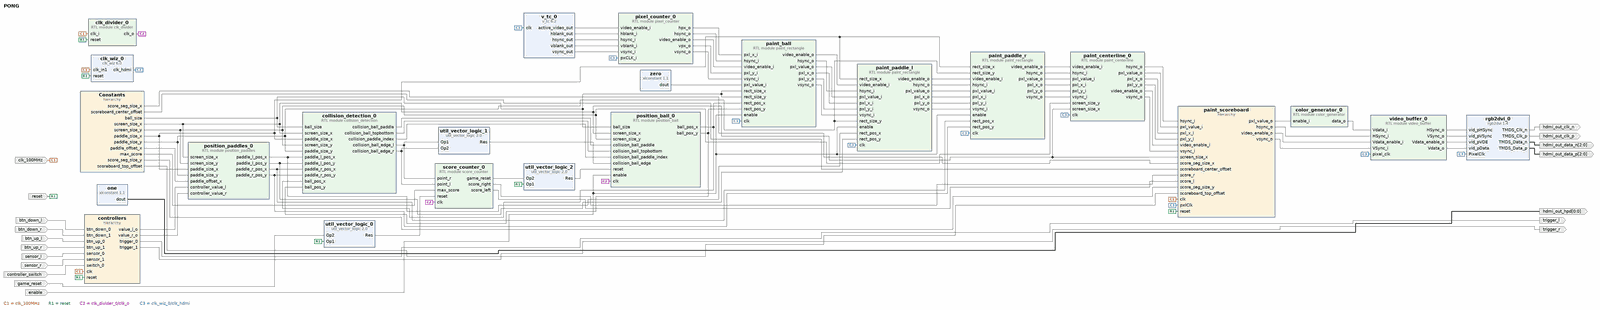
[diagram p0: block diagram of the top level, whole]
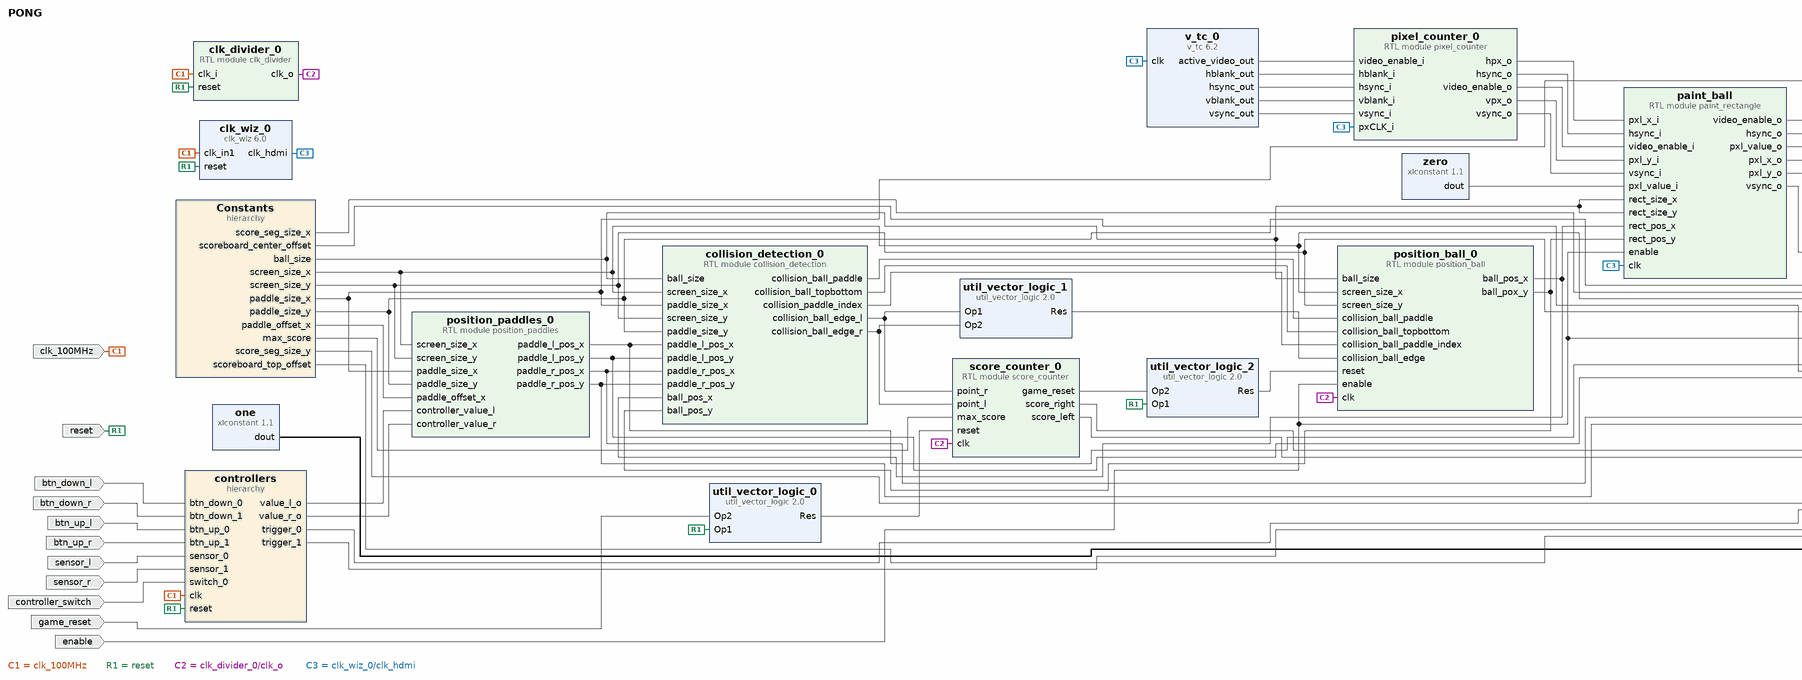
[diagram p1: block diagram of the top level, left part]
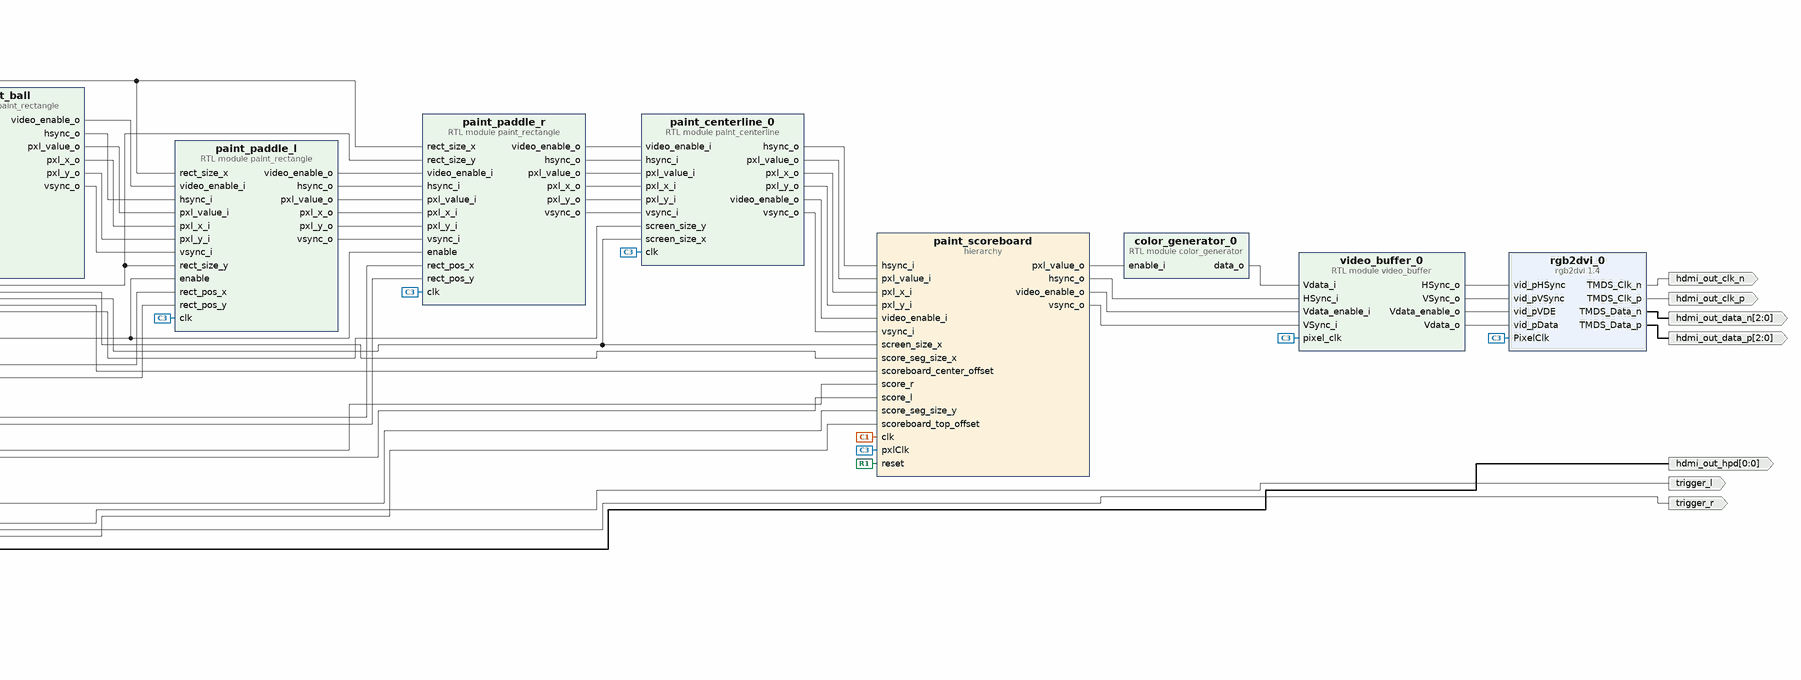
[diagram p2: block diagram of the top level, right part]
# Vivado block design PONG, xc7a35tcpg236-1, Vivado 2023.1
create_bd_design PONG

create_bd_port -dir O trigger_l
create_bd_port -dir O trigger_r
create_bd_port -dir I sensor_l
create_bd_port -dir I sensor_r
create_bd_port -dir I -type rst reset
set_property -dict {CONFIG.POLARITY ACTIVE_HIGH} [get_bd_ports reset]
create_bd_port -dir I controller_switch
create_bd_port -dir I btn_up_l
create_bd_port -dir I btn_down_l
create_bd_port -dir I btn_up_r
create_bd_port -dir I btn_down_r
create_bd_port -dir I enable
create_bd_port -dir O -from 0 -to 0 hdmi_out_hpd
create_bd_port -dir O -type clk hdmi_out_clk_p
create_bd_port -dir O -type clk hdmi_out_clk_n
create_bd_port -dir O -from 2 -to 0 hdmi_out_data_p
create_bd_port -dir O -from 2 -to 0 hdmi_out_data_n
create_bd_port -dir I -type clk clk_100MHz
set_property -dict {CONFIG.FREQ_HZ 100000000} [get_bd_ports clk_100MHz]
create_bd_port -dir I game_reset

create_bd_cell -type hier Constants
create_bd_cell -type hier controllers
create_bd_cell -type hier paint_scoreboard
create_bd_cell -type module -reference clk_divider clk_divider_0
set_property -dict {CONFIG.division 100000} [get_bd_cells clk_divider_0]
create_bd_cell -type module -reference collision_detection collision_detection_0
create_bd_cell -type module -reference paint_rectangle paint_ball
create_bd_cell -type module -reference paint_centerline paint_centerline_0
create_bd_cell -type module -reference paint_rectangle paint_paddle_l
create_bd_cell -type module -reference paint_rectangle paint_paddle_r
create_bd_cell -type module -reference position_ball position_ball_0
create_bd_cell -type module -reference position_paddles position_paddles_0
create_bd_cell -type module -reference score_counter score_counter_0
create_bd_cell -type ip -vlnv xilinx.com:ip:clk_wiz:6.0 clk_wiz_0
set_property -dict [list \
  CONFIG.CLKOUT1_JITTER 217.614 \
  CONFIG.CLKOUT1_PHASE_ERROR 245.344 \
  CONFIG.CLKOUT1_REQUESTED_OUT_FREQ 148.5 \
  CONFIG.CLK_OUT1_PORT clk_hdmi \
  CONFIG.MMCM_CLKFBOUT_MULT_F 37.125 \
  CONFIG.MMCM_CLKOUT0_DIVIDE_F 6.250 \
  CONFIG.MMCM_DIVCLK_DIVIDE 4 \
  CONFIG.PRIM_IN_FREQ 100.000 \
  CONFIG.USE_LOCKED false \
] [get_bd_cells clk_wiz_0]
create_bd_cell -type ip -vlnv xilinx.com:ip:xlconstant:1.1 one
create_bd_cell -type ip -vlnv digilentinc.com:ip:rgb2dvi:1.4 rgb2dvi_0
create_bd_cell -type ip -vlnv xilinx.com:ip:util_vector_logic:2.0 util_vector_logic_1
set_property -dict {CONFIG.C_OPERATION or CONFIG.C_SIZE 1} [get_bd_cells util_vector_logic_1]
create_bd_cell -type ip -vlnv xilinx.com:ip:util_vector_logic:2.0 util_vector_logic_2
set_property -dict {CONFIG.C_OPERATION or CONFIG.C_SIZE 1} [get_bd_cells util_vector_logic_2]
create_bd_cell -type ip -vlnv xilinx.com:ip:v_tc:6.2 v_tc_0
set_property -dict {CONFIG.HAS_AXI4_LITE false CONFIG.VIDEO_MODE 1080p CONFIG.enable_detection false} [get_bd_cells v_tc_0]
create_bd_cell -type ip -vlnv xilinx.com:ip:xlconstant:1.1 zero
set_property -dict {CONFIG.CONST_VAL 0} [get_bd_cells zero]
create_bd_cell -type module -reference color_generator color_generator_0
create_bd_cell -type module -reference pixel_counter pixel_counter_0
create_bd_cell -type module -reference video_buffer video_buffer_0
create_bd_cell -type ip -vlnv xilinx.com:ip:util_vector_logic:2.0 util_vector_logic_0
set_property -dict {CONFIG.C_OPERATION or CONFIG.C_SIZE 1} [get_bd_cells util_vector_logic_0]

# ---- hierarchy /Constants ----
current_bd_instance /Constants
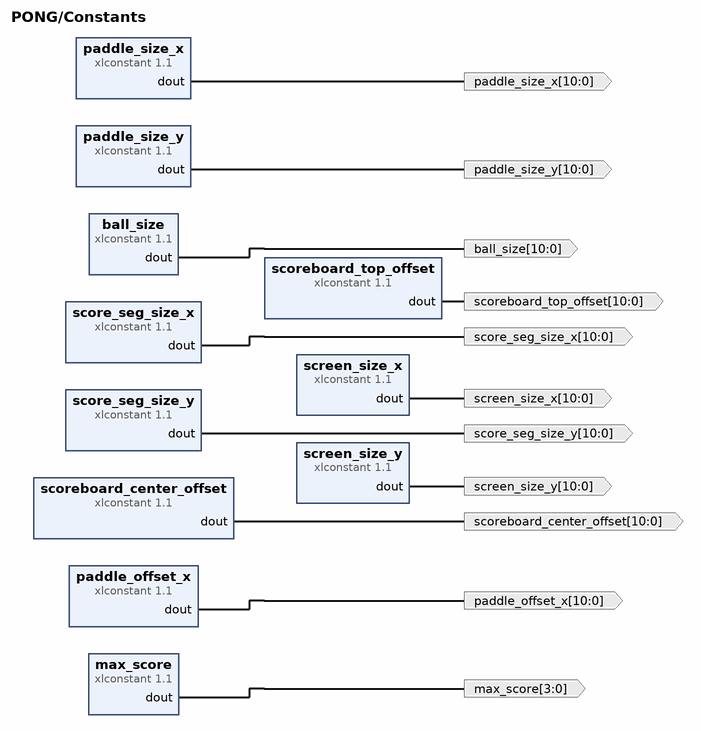
[diagram p3: block diagram inside /Constants]
create_bd_pin -dir O -from 10 -to 0 screen_size_x
create_bd_pin -dir O -from 10 -to 0 screen_size_y
create_bd_pin -dir O -from 10 -to 0 paddle_size_x
create_bd_pin -dir O -from 10 -to 0 paddle_size_y
create_bd_pin -dir O -from 10 -to 0 ball_size
create_bd_pin -dir O -from 10 -to 0 paddle_offset_x
create_bd_pin -dir O -from 3 -to 0 max_score
create_bd_pin -dir O -from 10 -to 0 score_seg_size_x
create_bd_pin -dir O -from 10 -to 0 score_seg_size_y
create_bd_pin -dir O -from 10 -to 0 scoreboard_center_offset
create_bd_pin -dir O -from 10 -to 0 scoreboard_top_offset

create_bd_cell -type ip -vlnv xilinx.com:ip:xlconstant:1.1 ball_size
set_property -dict {CONFIG.CONST_VAL 30 CONFIG.CONST_WIDTH 11} [get_bd_cells ball_size]
create_bd_cell -type ip -vlnv xilinx.com:ip:xlconstant:1.1 max_score
set_property -dict {CONFIG.CONST_VAL 9 CONFIG.CONST_WIDTH 4} [get_bd_cells max_score]
create_bd_cell -type ip -vlnv xilinx.com:ip:xlconstant:1.1 paddle_offset_x
set_property -dict {CONFIG.CONST_VAL 0 CONFIG.CONST_WIDTH 11} [get_bd_cells paddle_offset_x]
create_bd_cell -type ip -vlnv xilinx.com:ip:xlconstant:1.1 paddle_size_x
set_property -dict {CONFIG.CONST_VAL 40 CONFIG.CONST_WIDTH 11} [get_bd_cells paddle_size_x]
create_bd_cell -type ip -vlnv xilinx.com:ip:xlconstant:1.1 paddle_size_y
set_property -dict {CONFIG.CONST_VAL 300 CONFIG.CONST_WIDTH 11} [get_bd_cells paddle_size_y]
create_bd_cell -type ip -vlnv xilinx.com:ip:xlconstant:1.1 score_seg_size_x
set_property -dict {CONFIG.CONST_VAL 50 CONFIG.CONST_WIDTH 11} [get_bd_cells score_seg_size_x]
create_bd_cell -type ip -vlnv xilinx.com:ip:xlconstant:1.1 score_seg_size_y
set_property -dict {CONFIG.CONST_VAL 100 CONFIG.CONST_WIDTH 11} [get_bd_cells score_seg_size_y]
create_bd_cell -type ip -vlnv xilinx.com:ip:xlconstant:1.1 scoreboard_center_offset
set_property -dict {CONFIG.CONST_VAL 100 CONFIG.CONST_WIDTH 11} [get_bd_cells scoreboard_center_offset]
create_bd_cell -type ip -vlnv xilinx.com:ip:xlconstant:1.1 scoreboard_top_offset
set_property -dict {CONFIG.CONST_VAL 20 CONFIG.CONST_WIDTH 11} [get_bd_cells scoreboard_top_offset]
create_bd_cell -type ip -vlnv xilinx.com:ip:xlconstant:1.1 screen_size_x
set_property -dict {CONFIG.CONST_VAL 1920 CONFIG.CONST_WIDTH 11} [get_bd_cells screen_size_x]
create_bd_cell -type ip -vlnv xilinx.com:ip:xlconstant:1.1 screen_size_y
set_property -dict {CONFIG.CONST_VAL 1080 CONFIG.CONST_WIDTH 11} [get_bd_cells screen_size_y]

# ---- hierarchy /controllers ----
current_bd_instance /controllers
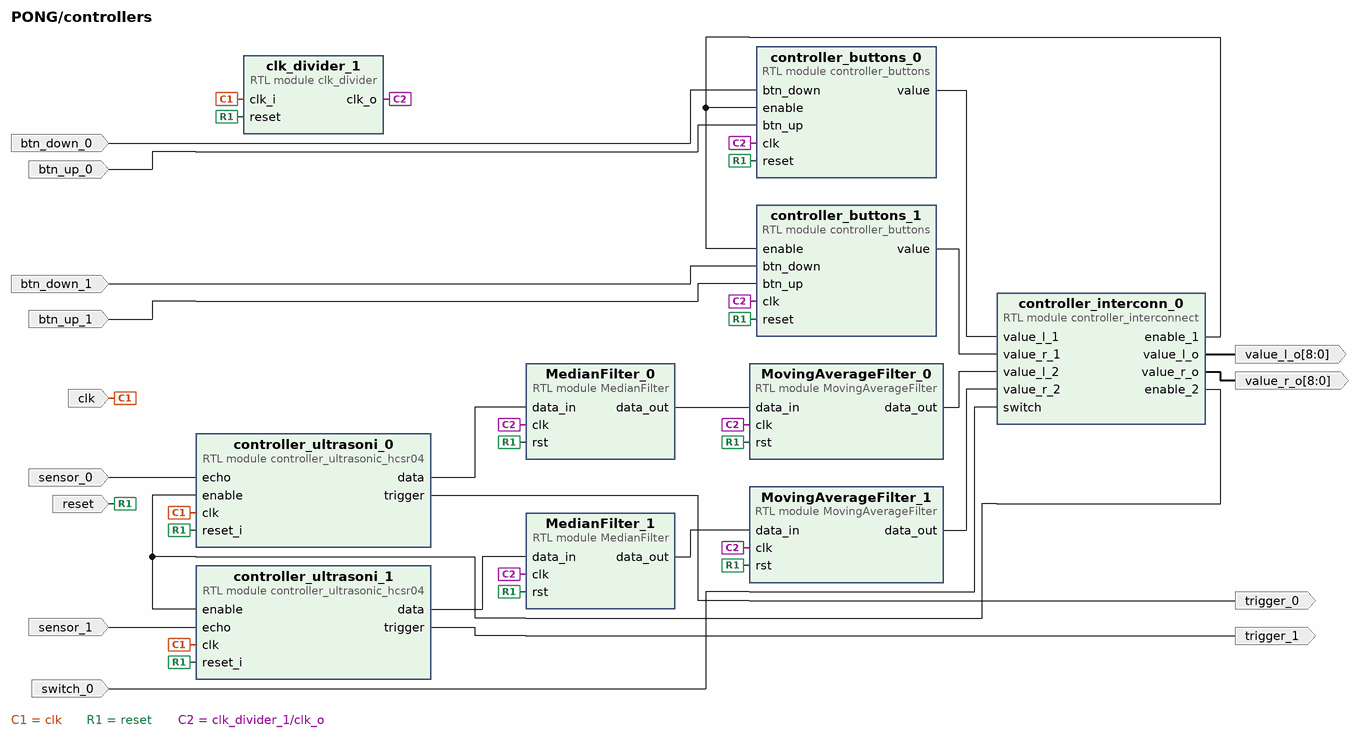
[diagram p4: block diagram inside /controllers]
create_bd_pin -dir I -type clk clk
create_bd_pin -dir I -type rst reset
create_bd_pin -dir I switch_0
create_bd_pin -dir O -from 8 -to 0 value_l_o
create_bd_pin -dir O -from 8 -to 0 value_r_o
create_bd_pin -dir I sensor_0
create_bd_pin -dir O trigger_0
create_bd_pin -dir I sensor_1
create_bd_pin -dir O trigger_1
create_bd_pin -dir I btn_up_1
create_bd_pin -dir I btn_down_1
create_bd_pin -dir I btn_up_0
create_bd_pin -dir I btn_down_0

create_bd_cell -type module -reference clk_divider clk_divider_1
set_property -dict {CONFIG.division 150000} [get_bd_cells clk_divider_1]
create_bd_cell -type module -reference controller_interconnect controller_interconn_0
create_bd_cell -type module -reference controller_buttons controller_buttons_0
create_bd_cell -type module -reference controller_buttons controller_buttons_1
create_bd_cell -type module -reference controller_ultrasonic_hcsr04 controller_ultrasoni_0
set_property -dict {CONFIG.MaxDistance_mm 300 CONFIG.MinDistance_mm 50} [get_bd_cells controller_ultrasoni_0]
create_bd_cell -type module -reference controller_ultrasonic_hcsr04 controller_ultrasoni_1
set_property -dict {CONFIG.MaxDistance_mm 300 CONFIG.MinDistance_mm 50} [get_bd_cells controller_ultrasoni_1]
create_bd_cell -type module -reference MedianFilter MedianFilter_0
create_bd_cell -type module -reference MedianFilter MedianFilter_1
create_bd_cell -type module -reference MovingAverageFilter MovingAverageFilter_0
create_bd_cell -type module -reference MovingAverageFilter MovingAverageFilter_1

# ---- hierarchy /paint_scoreboard ----
current_bd_instance /paint_scoreboard
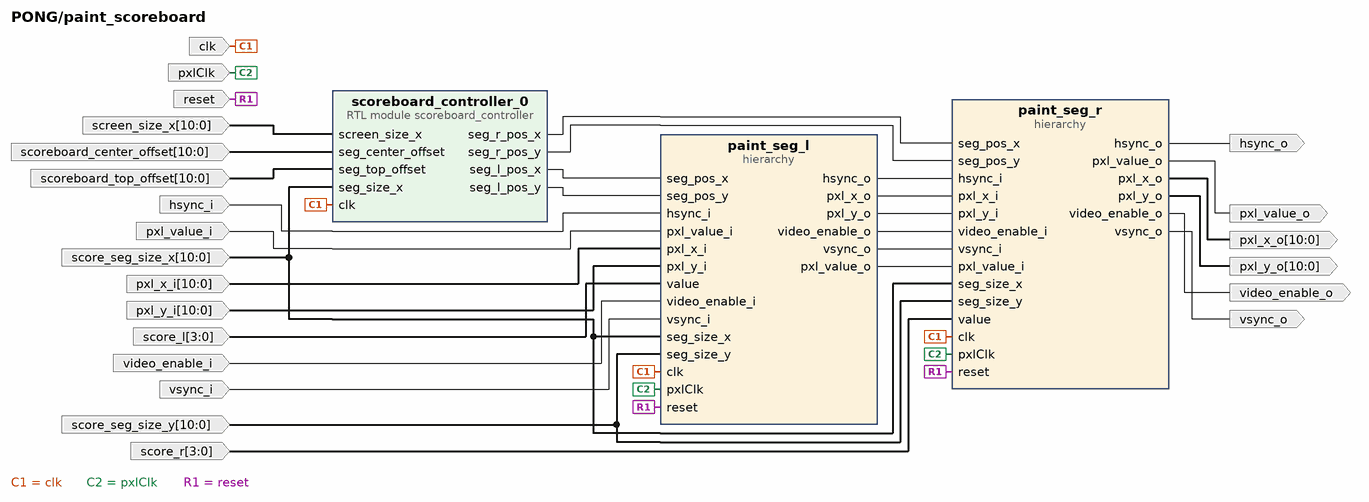
[diagram p5: block diagram inside /paint_scoreboard]
create_bd_pin -dir I video_enable_i
create_bd_pin -dir I hsync_i
create_bd_pin -dir I vsync_i
create_bd_pin -dir I -from 10 -to 0 pxl_x_i
create_bd_pin -dir I -from 10 -to 0 pxl_y_i
create_bd_pin -dir I pxl_value_i
create_bd_pin -dir O video_enable_o
create_bd_pin -dir O hsync_o
create_bd_pin -dir O vsync_o
create_bd_pin -dir O -from 10 -to 0 pxl_x_o
create_bd_pin -dir O -from 10 -to 0 pxl_y_o
create_bd_pin -dir O pxl_value_o
create_bd_pin -dir I pxlClk
create_bd_pin -dir I clk
create_bd_pin -dir I reset
create_bd_pin -dir I -from 3 -to 0 score_l
create_bd_pin -dir I -from 3 -to 0 score_r
create_bd_pin -dir I -from 10 -to 0 score_seg_size_x
create_bd_pin -dir I -from 10 -to 0 score_seg_size_y
create_bd_pin -dir I -from 10 -to 0 screen_size_x
create_bd_pin -dir I -from 10 -to 0 scoreboard_center_offset
create_bd_pin -dir I -from 10 -to 0 scoreboard_top_offset

create_bd_cell -type hier paint_seg_l
create_bd_cell -type hier paint_seg_r
create_bd_cell -type module -reference scoreboard_controller scoreboard_controller_0

# ---- hierarchy /paint_scoreboard/paint_seg_l ----
current_bd_instance /paint_scoreboard/paint_seg_l
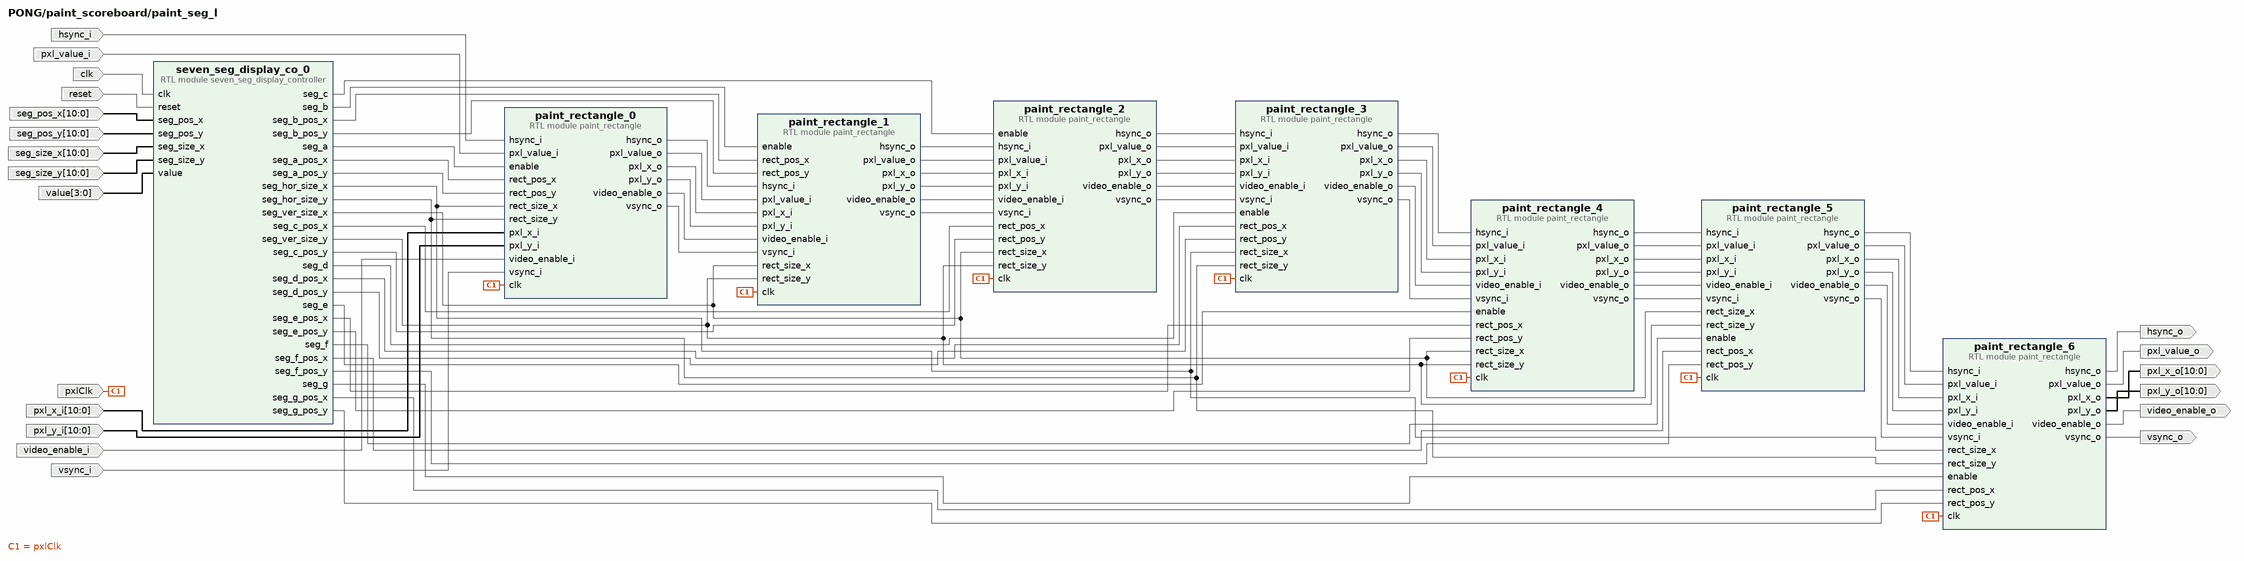
[diagram p6: block diagram inside /paint_scoreboard/paint_seg_l]
create_bd_pin -dir I pxlClk
create_bd_pin -dir I -type clk clk
create_bd_pin -dir I -type rst reset
create_bd_pin -dir I -from 3 -to 0 value
create_bd_pin -dir I -from 10 -to 0 seg_pos_x
create_bd_pin -dir I -from 10 -to 0 seg_pos_y
create_bd_pin -dir I -from 10 -to 0 seg_size_x
create_bd_pin -dir I -from 10 -to 0 seg_size_y
create_bd_pin -dir I video_enable_i
create_bd_pin -dir I hsync_i
create_bd_pin -dir I vsync_i
create_bd_pin -dir I -from 10 -to 0 pxl_x_i
create_bd_pin -dir I -from 10 -to 0 pxl_y_i
create_bd_pin -dir I pxl_value_i
create_bd_pin -dir O video_enable_o
create_bd_pin -dir O hsync_o
create_bd_pin -dir O vsync_o
create_bd_pin -dir O -from 10 -to 0 pxl_x_o
create_bd_pin -dir O -from 10 -to 0 pxl_y_o
create_bd_pin -dir O pxl_value_o

create_bd_cell -type module -reference paint_rectangle paint_rectangle_0
create_bd_cell -type module -reference paint_rectangle paint_rectangle_1
create_bd_cell -type module -reference paint_rectangle paint_rectangle_2
create_bd_cell -type module -reference paint_rectangle paint_rectangle_3
create_bd_cell -type module -reference paint_rectangle paint_rectangle_4
create_bd_cell -type module -reference paint_rectangle paint_rectangle_5
create_bd_cell -type module -reference paint_rectangle paint_rectangle_6
create_bd_cell -type module -reference seven_seg_display_controller seven_seg_display_co_0

# ---- hierarchy /paint_scoreboard/paint_seg_r ----
current_bd_instance /paint_scoreboard/paint_seg_r
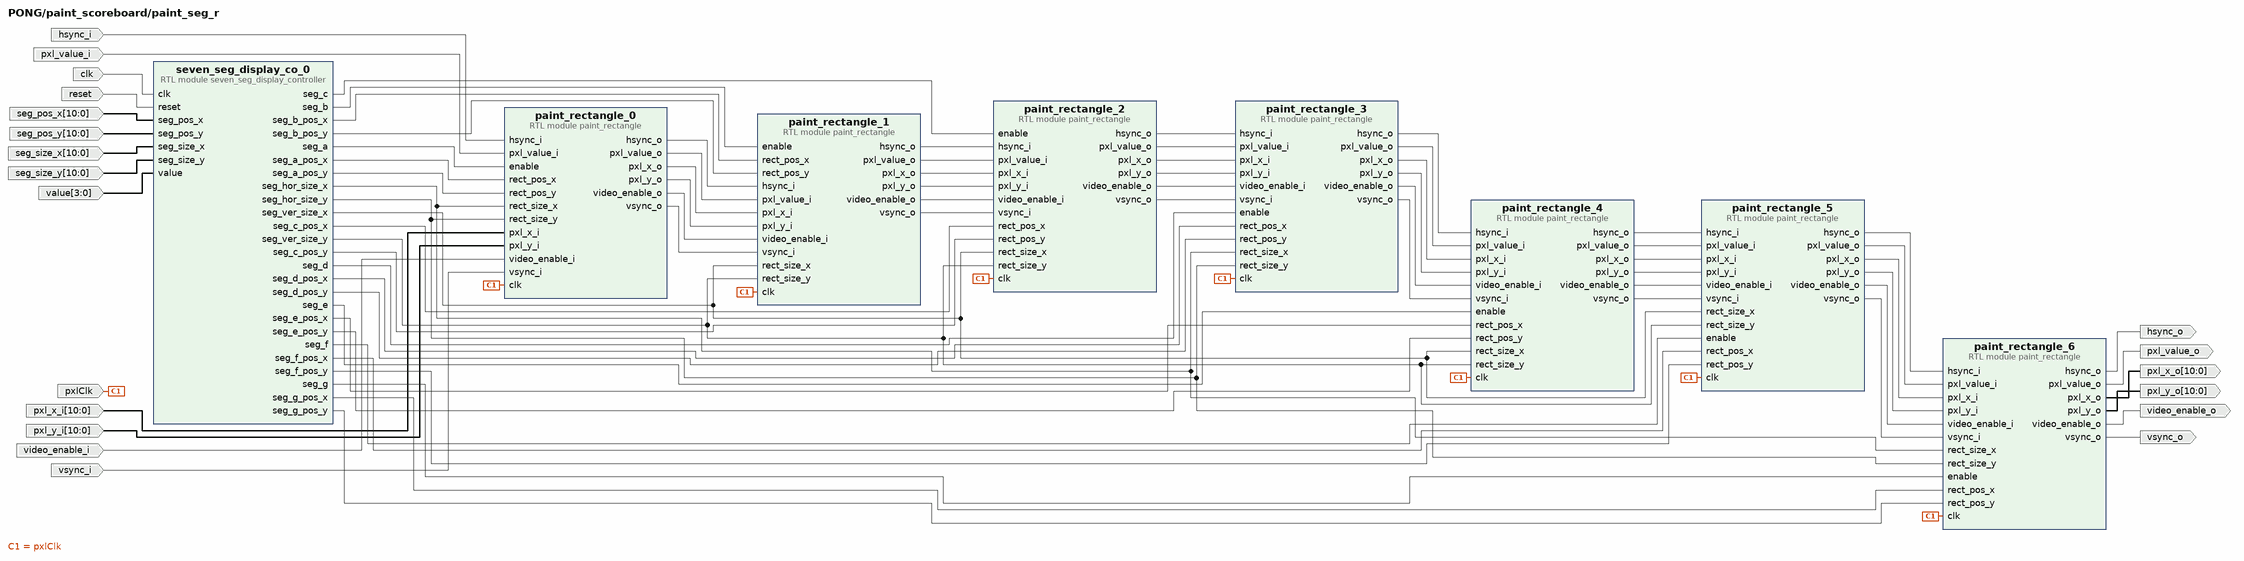
[diagram p7: block diagram inside /paint_scoreboard/paint_seg_r]
create_bd_pin -dir I pxlClk
create_bd_pin -dir I -type clk clk
create_bd_pin -dir I -type rst reset
create_bd_pin -dir I -from 3 -to 0 value
create_bd_pin -dir I -from 10 -to 0 seg_pos_x
create_bd_pin -dir I -from 10 -to 0 seg_pos_y
create_bd_pin -dir I -from 10 -to 0 seg_size_x
create_bd_pin -dir I -from 10 -to 0 seg_size_y
create_bd_pin -dir I video_enable_i
create_bd_pin -dir I hsync_i
create_bd_pin -dir I vsync_i
create_bd_pin -dir I -from 10 -to 0 pxl_x_i
create_bd_pin -dir I -from 10 -to 0 pxl_y_i
create_bd_pin -dir I pxl_value_i
create_bd_pin -dir O video_enable_o
create_bd_pin -dir O hsync_o
create_bd_pin -dir O vsync_o
create_bd_pin -dir O -from 10 -to 0 pxl_x_o
create_bd_pin -dir O -from 10 -to 0 pxl_y_o
create_bd_pin -dir O pxl_value_o

create_bd_cell -type module -reference paint_rectangle paint_rectangle_0
create_bd_cell -type module -reference paint_rectangle paint_rectangle_1
create_bd_cell -type module -reference paint_rectangle paint_rectangle_2
create_bd_cell -type module -reference paint_rectangle paint_rectangle_3
create_bd_cell -type module -reference paint_rectangle paint_rectangle_4
create_bd_cell -type module -reference paint_rectangle paint_rectangle_5
create_bd_cell -type module -reference paint_rectangle paint_rectangle_6
create_bd_cell -type module -reference seven_seg_display_controller seven_seg_display_co_0

# ---- connections ----

current_bd_instance /Constants
connect_bd_net [get_bd_pins screen_size_x/dout] [get_bd_pins screen_size_x]
connect_bd_net [get_bd_pins screen_size_y/dout] [get_bd_pins screen_size_y]
connect_bd_net [get_bd_pins paddle_size_x/dout] [get_bd_pins paddle_size_x]
connect_bd_net [get_bd_pins paddle_size_y/dout] [get_bd_pins paddle_size_y]
connect_bd_net [get_bd_pins ball_size/dout] [get_bd_pins ball_size]
connect_bd_net [get_bd_pins score_seg_size_x/dout] [get_bd_pins score_seg_size_x]
connect_bd_net [get_bd_pins score_seg_size_y/dout] [get_bd_pins score_seg_size_y]
connect_bd_net [get_bd_pins scoreboard_center_offset/dout] [get_bd_pins scoreboard_center_offset]
connect_bd_net [get_bd_pins scoreboard_top_offset/dout] [get_bd_pins scoreboard_top_offset]
connect_bd_net -net xlconstant_5_dout [get_bd_pins paddle_offset_x/dout] [get_bd_pins paddle_offset_x]
connect_bd_net -net xlconstant_6_dout [get_bd_pins max_score/dout] [get_bd_pins max_score]

current_bd_instance /controllers
connect_bd_net [get_bd_pins MedianFilter_0/data_out] [get_bd_pins MovingAverageFilter_0/data_in]
connect_bd_net [get_bd_pins MedianFilter_1/data_out] [get_bd_pins MovingAverageFilter_1/data_in]
connect_bd_net [get_bd_pins MovingAverageFilter_0/data_out] [get_bd_pins controller_interconn_0/value_l_2]
connect_bd_net [get_bd_pins MovingAverageFilter_1/data_out] [get_bd_pins controller_interconn_0/value_r_2]
connect_bd_net [get_bd_pins clk] [get_bd_pins clk_divider_1/clk_i] [get_bd_pins controller_ultrasoni_0/clk] [get_bd_pins controller_ultrasoni_1/clk]
connect_bd_net [get_bd_pins controller_interconn_0/enable_2] [get_bd_pins controller_ultrasoni_0/enable] [get_bd_pins controller_ultrasoni_1/enable]
connect_bd_net [get_bd_pins reset] \
  [get_bd_pins clk_divider_1/reset] [get_bd_pins controller_buttons_0/reset] [get_bd_pins controller_buttons_1/reset] \
  [get_bd_pins controller_ultrasoni_0/reset_i] [get_bd_pins controller_ultrasoni_1/reset_i] [get_bd_pins MedianFilter_0/rst] \
  [get_bd_pins MedianFilter_1/rst] [get_bd_pins MovingAverageFilter_0/rst] [get_bd_pins MovingAverageFilter_1/rst]
connect_bd_net -net btn_down_0_1 [get_bd_pins btn_down_0] [get_bd_pins controller_buttons_0/btn_down]
connect_bd_net -net btn_down_1_1 [get_bd_pins btn_down_1] [get_bd_pins controller_buttons_1/btn_down]
connect_bd_net -net btn_up_0_1 [get_bd_pins btn_up_0] [get_bd_pins controller_buttons_0/btn_up]
connect_bd_net -net btn_up_1_1 [get_bd_pins btn_up_1] [get_bd_pins controller_buttons_1/btn_up]
connect_bd_net [get_bd_pins clk_divider_1/clk_o] \
  [get_bd_pins controller_buttons_0/clk] [get_bd_pins controller_buttons_1/clk] [get_bd_pins MedianFilter_0/clk] \
  [get_bd_pins MedianFilter_1/clk] [get_bd_pins MovingAverageFilter_0/clk] [get_bd_pins MovingAverageFilter_1/clk]
connect_bd_net [get_bd_pins controller_buttons_0/value] [get_bd_pins controller_interconn_0/value_l_1]
connect_bd_net [get_bd_pins controller_buttons_1/value] [get_bd_pins controller_interconn_0/value_r_1]
connect_bd_net [get_bd_pins controller_interconn_0/enable_1] [get_bd_pins controller_buttons_0/enable] [get_bd_pins controller_buttons_1/enable]
connect_bd_net [get_bd_pins controller_interconn_0/value_l_o] [get_bd_pins value_l_o]
connect_bd_net [get_bd_pins controller_interconn_0/value_r_o] [get_bd_pins value_r_o]
connect_bd_net [get_bd_pins controller_ultrasoni_0/data] [get_bd_pins MedianFilter_0/data_in]
connect_bd_net [get_bd_pins controller_ultrasoni_0/trigger] [get_bd_pins trigger_0]
connect_bd_net [get_bd_pins controller_ultrasoni_1/data] [get_bd_pins MedianFilter_1/data_in]
connect_bd_net [get_bd_pins controller_ultrasoni_1/trigger] [get_bd_pins trigger_1]
connect_bd_net -net sensor_0_1 [get_bd_pins sensor_0] [get_bd_pins controller_ultrasoni_0/echo]
connect_bd_net -net sensor_1_1 [get_bd_pins sensor_1] [get_bd_pins controller_ultrasoni_1/echo]
connect_bd_net -net switch_0_1 [get_bd_pins switch_0] [get_bd_pins controller_interconn_0/switch]

current_bd_instance /paint_scoreboard
connect_bd_net [get_bd_pins clk] [get_bd_pins paint_seg_r/clk] [get_bd_pins paint_seg_l/clk] [get_bd_pins scoreboard_controller_0/clk]
connect_bd_net [get_bd_pins hsync_i] [get_bd_pins paint_seg_l/hsync_i]
connect_bd_net [get_bd_pins paint_seg_l/hsync_o] [get_bd_pins paint_seg_r/hsync_i]
connect_bd_net [get_bd_pins paint_seg_l/pxl_x_o] [get_bd_pins paint_seg_r/pxl_x_i]
connect_bd_net [get_bd_pins paint_seg_l/pxl_y_o] [get_bd_pins paint_seg_r/pxl_y_i]
connect_bd_net [get_bd_pins paint_seg_l/video_enable_o] [get_bd_pins paint_seg_r/video_enable_i]
connect_bd_net [get_bd_pins paint_seg_l/vsync_o] [get_bd_pins paint_seg_r/vsync_i]
connect_bd_net [get_bd_pins paint_seg_r/hsync_o] [get_bd_pins hsync_o]
connect_bd_net [get_bd_pins paint_seg_r/pxl_value_o] [get_bd_pins pxl_value_o]
connect_bd_net [get_bd_pins paint_seg_r/pxl_x_o] [get_bd_pins pxl_x_o]
connect_bd_net [get_bd_pins paint_seg_r/pxl_y_o] [get_bd_pins pxl_y_o]
connect_bd_net [get_bd_pins paint_seg_r/video_enable_o] [get_bd_pins video_enable_o]
connect_bd_net [get_bd_pins paint_seg_r/vsync_o] [get_bd_pins vsync_o]
connect_bd_net [get_bd_pins pxlClk] [get_bd_pins paint_seg_l/pxlClk] [get_bd_pins paint_seg_r/pxlClk]
connect_bd_net -net pxl_value_i_1 [get_bd_pins paint_seg_l/pxl_value_o] [get_bd_pins paint_seg_r/pxl_value_i]
connect_bd_net [get_bd_pins pxl_value_i] [get_bd_pins paint_seg_l/pxl_value_i]
connect_bd_net [get_bd_pins pxl_x_i] [get_bd_pins paint_seg_l/pxl_x_i]
connect_bd_net [get_bd_pins pxl_y_i] [get_bd_pins paint_seg_l/pxl_y_i]
connect_bd_net [get_bd_pins reset] [get_bd_pins paint_seg_l/reset] [get_bd_pins paint_seg_r/reset]
connect_bd_net [get_bd_pins scoreboard_controller_0/seg_l_pos_x] [get_bd_pins paint_seg_l/seg_pos_x]
connect_bd_net [get_bd_pins scoreboard_controller_0/seg_l_pos_y] [get_bd_pins paint_seg_l/seg_pos_y]
connect_bd_net [get_bd_pins scoreboard_controller_0/seg_r_pos_x] [get_bd_pins paint_seg_r/seg_pos_x]
connect_bd_net [get_bd_pins scoreboard_controller_0/seg_r_pos_y] [get_bd_pins paint_seg_r/seg_pos_y]
connect_bd_net -net screen_size_x_0_1 [get_bd_pins screen_size_x] [get_bd_pins scoreboard_controller_0/screen_size_x]
connect_bd_net -net seg_center_offset_0_1 [get_bd_pins scoreboard_center_offset] [get_bd_pins scoreboard_controller_0/seg_center_offset]
connect_bd_net -net seg_size_x_1 [get_bd_pins score_seg_size_x] \
  [get_bd_pins paint_seg_l/seg_size_x] [get_bd_pins paint_seg_r/seg_size_x] [get_bd_pins scoreboard_controller_0/seg_size_x]
connect_bd_net -net seg_size_y_1 [get_bd_pins score_seg_size_y] [get_bd_pins paint_seg_l/seg_size_y] [get_bd_pins paint_seg_r/seg_size_y]
connect_bd_net -net seg_top_offset_0_1 [get_bd_pins scoreboard_top_offset] [get_bd_pins scoreboard_controller_0/seg_top_offset]
connect_bd_net -net value_1 [get_bd_pins score_r] [get_bd_pins paint_seg_r/value]
connect_bd_net -net value_2 [get_bd_pins score_l] [get_bd_pins paint_seg_l/value]
connect_bd_net [get_bd_pins video_enable_i] [get_bd_pins paint_seg_l/video_enable_i]
connect_bd_net [get_bd_pins vsync_i] [get_bd_pins paint_seg_l/vsync_i]

current_bd_instance /paint_scoreboard/paint_seg_l
connect_bd_net [get_bd_pins pxlClk] \
  [get_bd_pins paint_rectangle_0/clk] [get_bd_pins paint_rectangle_1/clk] [get_bd_pins paint_rectangle_2/clk] \
  [get_bd_pins paint_rectangle_3/clk] [get_bd_pins paint_rectangle_4/clk] [get_bd_pins paint_rectangle_5/clk] \
  [get_bd_pins paint_rectangle_6/clk]
connect_bd_net -net clk_1_1 [get_bd_pins clk] [get_bd_pins seven_seg_display_co_0/clk]
connect_bd_net -net hsync_i_0_1 [get_bd_pins hsync_i] [get_bd_pins paint_rectangle_0/hsync_i]
connect_bd_net [get_bd_pins paint_rectangle_0/hsync_o] [get_bd_pins paint_rectangle_1/hsync_i]
connect_bd_net [get_bd_pins paint_rectangle_0/pxl_value_o] [get_bd_pins paint_rectangle_1/pxl_value_i]
connect_bd_net [get_bd_pins paint_rectangle_0/pxl_x_o] [get_bd_pins paint_rectangle_1/pxl_x_i]
connect_bd_net [get_bd_pins paint_rectangle_0/pxl_y_o] [get_bd_pins paint_rectangle_1/pxl_y_i]
connect_bd_net [get_bd_pins paint_rectangle_0/video_enable_o] [get_bd_pins paint_rectangle_1/video_enable_i]
connect_bd_net [get_bd_pins paint_rectangle_0/vsync_o] [get_bd_pins paint_rectangle_1/vsync_i]
connect_bd_net [get_bd_pins paint_rectangle_1/hsync_o] [get_bd_pins paint_rectangle_2/hsync_i]
connect_bd_net [get_bd_pins paint_rectangle_1/pxl_value_o] [get_bd_pins paint_rectangle_2/pxl_value_i]
connect_bd_net [get_bd_pins paint_rectangle_1/pxl_x_o] [get_bd_pins paint_rectangle_2/pxl_x_i]
connect_bd_net [get_bd_pins paint_rectangle_1/pxl_y_o] [get_bd_pins paint_rectangle_2/pxl_y_i]
connect_bd_net [get_bd_pins paint_rectangle_1/video_enable_o] [get_bd_pins paint_rectangle_2/video_enable_i]
connect_bd_net [get_bd_pins paint_rectangle_1/vsync_o] [get_bd_pins paint_rectangle_2/vsync_i]
connect_bd_net [get_bd_pins paint_rectangle_2/hsync_o] [get_bd_pins paint_rectangle_3/hsync_i]
connect_bd_net [get_bd_pins paint_rectangle_2/pxl_value_o] [get_bd_pins paint_rectangle_3/pxl_value_i]
connect_bd_net [get_bd_pins paint_rectangle_2/pxl_x_o] [get_bd_pins paint_rectangle_3/pxl_x_i]
connect_bd_net [get_bd_pins paint_rectangle_2/pxl_y_o] [get_bd_pins paint_rectangle_3/pxl_y_i]
connect_bd_net [get_bd_pins paint_rectangle_2/video_enable_o] [get_bd_pins paint_rectangle_3/video_enable_i]
connect_bd_net [get_bd_pins paint_rectangle_2/vsync_o] [get_bd_pins paint_rectangle_3/vsync_i]
connect_bd_net [get_bd_pins paint_rectangle_3/hsync_o] [get_bd_pins paint_rectangle_4/hsync_i]
connect_bd_net [get_bd_pins paint_rectangle_3/pxl_value_o] [get_bd_pins paint_rectangle_4/pxl_value_i]
connect_bd_net [get_bd_pins paint_rectangle_3/pxl_x_o] [get_bd_pins paint_rectangle_4/pxl_x_i]
connect_bd_net [get_bd_pins paint_rectangle_3/pxl_y_o] [get_bd_pins paint_rectangle_4/pxl_y_i]
connect_bd_net [get_bd_pins paint_rectangle_3/video_enable_o] [get_bd_pins paint_rectangle_4/video_enable_i]
connect_bd_net [get_bd_pins paint_rectangle_3/vsync_o] [get_bd_pins paint_rectangle_4/vsync_i]
connect_bd_net [get_bd_pins paint_rectangle_4/hsync_o] [get_bd_pins paint_rectangle_5/hsync_i]
connect_bd_net [get_bd_pins paint_rectangle_4/pxl_value_o] [get_bd_pins paint_rectangle_5/pxl_value_i]
connect_bd_net [get_bd_pins paint_rectangle_4/pxl_x_o] [get_bd_pins paint_rectangle_5/pxl_x_i]
connect_bd_net [get_bd_pins paint_rectangle_4/pxl_y_o] [get_bd_pins paint_rectangle_5/pxl_y_i]
connect_bd_net [get_bd_pins paint_rectangle_4/video_enable_o] [get_bd_pins paint_rectangle_5/video_enable_i]
connect_bd_net [get_bd_pins paint_rectangle_4/vsync_o] [get_bd_pins paint_rectangle_5/vsync_i]
connect_bd_net [get_bd_pins paint_rectangle_5/hsync_o] [get_bd_pins paint_rectangle_6/hsync_i]
connect_bd_net [get_bd_pins paint_rectangle_5/pxl_value_o] [get_bd_pins paint_rectangle_6/pxl_value_i]
connect_bd_net [get_bd_pins paint_rectangle_5/pxl_x_o] [get_bd_pins paint_rectangle_6/pxl_x_i]
connect_bd_net [get_bd_pins paint_rectangle_5/pxl_y_o] [get_bd_pins paint_rectangle_6/pxl_y_i]
connect_bd_net [get_bd_pins paint_rectangle_5/video_enable_o] [get_bd_pins paint_rectangle_6/video_enable_i]
connect_bd_net [get_bd_pins paint_rectangle_5/vsync_o] [get_bd_pins paint_rectangle_6/vsync_i]
connect_bd_net [get_bd_pins paint_rectangle_6/hsync_o] [get_bd_pins hsync_o]
connect_bd_net [get_bd_pins paint_rectangle_6/pxl_value_o] [get_bd_pins pxl_value_o]
connect_bd_net [get_bd_pins paint_rectangle_6/pxl_x_o] [get_bd_pins pxl_x_o]
connect_bd_net [get_bd_pins paint_rectangle_6/pxl_y_o] [get_bd_pins pxl_y_o]
connect_bd_net [get_bd_pins paint_rectangle_6/video_enable_o] [get_bd_pins video_enable_o]
connect_bd_net [get_bd_pins paint_rectangle_6/vsync_o] [get_bd_pins vsync_o]
connect_bd_net -net pxl_value_i_0_1 [get_bd_pins pxl_value_i] [get_bd_pins paint_rectangle_0/pxl_value_i]
connect_bd_net -net pxl_x_i_0_1 [get_bd_pins pxl_x_i] [get_bd_pins paint_rectangle_0/pxl_x_i]
connect_bd_net -net pxl_y_i_0_1 [get_bd_pins pxl_y_i] [get_bd_pins paint_rectangle_0/pxl_y_i]
connect_bd_net -net reset_0_1 [get_bd_pins reset] [get_bd_pins seven_seg_display_co_0/reset]
connect_bd_net -net seg_pos_x_0_1 [get_bd_pins seg_pos_x] [get_bd_pins seven_seg_display_co_0/seg_pos_x]
connect_bd_net -net seg_pos_y_0_1 [get_bd_pins seg_pos_y] [get_bd_pins seven_seg_display_co_0/seg_pos_y]
connect_bd_net -net seg_size_x_0_1 [get_bd_pins seg_size_x] [get_bd_pins seven_seg_display_co_0/seg_size_x]
connect_bd_net -net seg_size_y_0_1 [get_bd_pins seg_size_y] [get_bd_pins seven_seg_display_co_0/seg_size_y]
connect_bd_net [get_bd_pins seven_seg_display_co_0/seg_a] [get_bd_pins paint_rectangle_0/enable]
connect_bd_net [get_bd_pins seven_seg_display_co_0/seg_a_pos_x] [get_bd_pins paint_rectangle_0/rect_pos_x]
connect_bd_net [get_bd_pins seven_seg_display_co_0/seg_a_pos_y] [get_bd_pins paint_rectangle_0/rect_pos_y]
connect_bd_net [get_bd_pins seven_seg_display_co_0/seg_b] [get_bd_pins paint_rectangle_1/enable]
connect_bd_net [get_bd_pins seven_seg_display_co_0/seg_b_pos_x] [get_bd_pins paint_rectangle_1/rect_pos_x]
connect_bd_net [get_bd_pins seven_seg_display_co_0/seg_b_pos_y] [get_bd_pins paint_rectangle_1/rect_pos_y]
connect_bd_net [get_bd_pins seven_seg_display_co_0/seg_c] [get_bd_pins paint_rectangle_2/enable]
connect_bd_net [get_bd_pins seven_seg_display_co_0/seg_c_pos_x] [get_bd_pins paint_rectangle_2/rect_pos_x]
connect_bd_net [get_bd_pins seven_seg_display_co_0/seg_c_pos_y] [get_bd_pins paint_rectangle_2/rect_pos_y]
connect_bd_net [get_bd_pins seven_seg_display_co_0/seg_d] [get_bd_pins paint_rectangle_3/enable]
connect_bd_net [get_bd_pins seven_seg_display_co_0/seg_d_pos_x] [get_bd_pins paint_rectangle_3/rect_pos_x]
connect_bd_net [get_bd_pins seven_seg_display_co_0/seg_d_pos_y] [get_bd_pins paint_rectangle_3/rect_pos_y]
connect_bd_net [get_bd_pins seven_seg_display_co_0/seg_e] [get_bd_pins paint_rectangle_4/enable]
connect_bd_net [get_bd_pins seven_seg_display_co_0/seg_e_pos_x] [get_bd_pins paint_rectangle_4/rect_pos_x]
connect_bd_net [get_bd_pins seven_seg_display_co_0/seg_e_pos_y] [get_bd_pins paint_rectangle_4/rect_pos_y]
connect_bd_net [get_bd_pins seven_seg_display_co_0/seg_f] [get_bd_pins paint_rectangle_5/enable]
connect_bd_net [get_bd_pins seven_seg_display_co_0/seg_f_pos_x] [get_bd_pins paint_rectangle_5/rect_pos_x]
connect_bd_net [get_bd_pins seven_seg_display_co_0/seg_f_pos_y] [get_bd_pins paint_rectangle_5/rect_pos_y]
connect_bd_net [get_bd_pins seven_seg_display_co_0/seg_g] [get_bd_pins paint_rectangle_6/enable]
connect_bd_net [get_bd_pins seven_seg_display_co_0/seg_g_pos_x] [get_bd_pins paint_rectangle_6/rect_pos_x]
connect_bd_net [get_bd_pins seven_seg_display_co_0/seg_g_pos_y] [get_bd_pins paint_rectangle_6/rect_pos_y]
connect_bd_net [get_bd_pins seven_seg_display_co_0/seg_hor_size_x] \
  [get_bd_pins paint_rectangle_0/rect_size_x] [get_bd_pins paint_rectangle_3/rect_size_x] \
  [get_bd_pins paint_rectangle_6/rect_size_x]
connect_bd_net [get_bd_pins seven_seg_display_co_0/seg_hor_size_y] \
  [get_bd_pins paint_rectangle_0/rect_size_y] [get_bd_pins paint_rectangle_3/rect_size_y] \
  [get_bd_pins paint_rectangle_6/rect_size_y]
connect_bd_net [get_bd_pins seven_seg_display_co_0/seg_ver_size_x] \
  [get_bd_pins paint_rectangle_1/rect_size_x] [get_bd_pins paint_rectangle_2/rect_size_x] \
  [get_bd_pins paint_rectangle_4/rect_size_x] [get_bd_pins paint_rectangle_5/rect_size_x]
connect_bd_net [get_bd_pins seven_seg_display_co_0/seg_ver_size_y] \
  [get_bd_pins paint_rectangle_1/rect_size_y] [get_bd_pins paint_rectangle_2/rect_size_y] \
  [get_bd_pins paint_rectangle_4/rect_size_y] [get_bd_pins paint_rectangle_5/rect_size_y]
connect_bd_net -net value_0_1 [get_bd_pins value] [get_bd_pins seven_seg_display_co_0/value]
connect_bd_net -net video_enable_i_0_1 [get_bd_pins video_enable_i] [get_bd_pins paint_rectangle_0/video_enable_i]
connect_bd_net -net vsync_i_0_1 [get_bd_pins vsync_i] [get_bd_pins paint_rectangle_0/vsync_i]

current_bd_instance /paint_scoreboard/paint_seg_r
connect_bd_net [get_bd_pins pxlClk] \
  [get_bd_pins paint_rectangle_0/clk] [get_bd_pins paint_rectangle_1/clk] [get_bd_pins paint_rectangle_2/clk] \
  [get_bd_pins paint_rectangle_3/clk] [get_bd_pins paint_rectangle_4/clk] [get_bd_pins paint_rectangle_5/clk] \
  [get_bd_pins paint_rectangle_6/clk]
connect_bd_net -net clk_1_1 [get_bd_pins clk] [get_bd_pins seven_seg_display_co_0/clk]
connect_bd_net -net hsync_i_0_1 [get_bd_pins hsync_i] [get_bd_pins paint_rectangle_0/hsync_i]
connect_bd_net [get_bd_pins paint_rectangle_0/hsync_o] [get_bd_pins paint_rectangle_1/hsync_i]
connect_bd_net [get_bd_pins paint_rectangle_0/pxl_value_o] [get_bd_pins paint_rectangle_1/pxl_value_i]
connect_bd_net [get_bd_pins paint_rectangle_0/pxl_x_o] [get_bd_pins paint_rectangle_1/pxl_x_i]
connect_bd_net [get_bd_pins paint_rectangle_0/pxl_y_o] [get_bd_pins paint_rectangle_1/pxl_y_i]
connect_bd_net [get_bd_pins paint_rectangle_0/video_enable_o] [get_bd_pins paint_rectangle_1/video_enable_i]
connect_bd_net [get_bd_pins paint_rectangle_0/vsync_o] [get_bd_pins paint_rectangle_1/vsync_i]
connect_bd_net [get_bd_pins paint_rectangle_1/hsync_o] [get_bd_pins paint_rectangle_2/hsync_i]
connect_bd_net [get_bd_pins paint_rectangle_1/pxl_value_o] [get_bd_pins paint_rectangle_2/pxl_value_i]
connect_bd_net [get_bd_pins paint_rectangle_1/pxl_x_o] [get_bd_pins paint_rectangle_2/pxl_x_i]
connect_bd_net [get_bd_pins paint_rectangle_1/pxl_y_o] [get_bd_pins paint_rectangle_2/pxl_y_i]
connect_bd_net [get_bd_pins paint_rectangle_1/video_enable_o] [get_bd_pins paint_rectangle_2/video_enable_i]
connect_bd_net [get_bd_pins paint_rectangle_1/vsync_o] [get_bd_pins paint_rectangle_2/vsync_i]
connect_bd_net [get_bd_pins paint_rectangle_2/hsync_o] [get_bd_pins paint_rectangle_3/hsync_i]
connect_bd_net [get_bd_pins paint_rectangle_2/pxl_value_o] [get_bd_pins paint_rectangle_3/pxl_value_i]
connect_bd_net [get_bd_pins paint_rectangle_2/pxl_x_o] [get_bd_pins paint_rectangle_3/pxl_x_i]
connect_bd_net [get_bd_pins paint_rectangle_2/pxl_y_o] [get_bd_pins paint_rectangle_3/pxl_y_i]
connect_bd_net [get_bd_pins paint_rectangle_2/video_enable_o] [get_bd_pins paint_rectangle_3/video_enable_i]
connect_bd_net [get_bd_pins paint_rectangle_2/vsync_o] [get_bd_pins paint_rectangle_3/vsync_i]
connect_bd_net [get_bd_pins paint_rectangle_3/hsync_o] [get_bd_pins paint_rectangle_4/hsync_i]
connect_bd_net [get_bd_pins paint_rectangle_3/pxl_value_o] [get_bd_pins paint_rectangle_4/pxl_value_i]
connect_bd_net [get_bd_pins paint_rectangle_3/pxl_x_o] [get_bd_pins paint_rectangle_4/pxl_x_i]
connect_bd_net [get_bd_pins paint_rectangle_3/pxl_y_o] [get_bd_pins paint_rectangle_4/pxl_y_i]
connect_bd_net [get_bd_pins paint_rectangle_3/video_enable_o] [get_bd_pins paint_rectangle_4/video_enable_i]
connect_bd_net [get_bd_pins paint_rectangle_3/vsync_o] [get_bd_pins paint_rectangle_4/vsync_i]
connect_bd_net [get_bd_pins paint_rectangle_4/hsync_o] [get_bd_pins paint_rectangle_5/hsync_i]
connect_bd_net [get_bd_pins paint_rectangle_4/pxl_value_o] [get_bd_pins paint_rectangle_5/pxl_value_i]
connect_bd_net [get_bd_pins paint_rectangle_4/pxl_x_o] [get_bd_pins paint_rectangle_5/pxl_x_i]
connect_bd_net [get_bd_pins paint_rectangle_4/pxl_y_o] [get_bd_pins paint_rectangle_5/pxl_y_i]
connect_bd_net [get_bd_pins paint_rectangle_4/video_enable_o] [get_bd_pins paint_rectangle_5/video_enable_i]
connect_bd_net [get_bd_pins paint_rectangle_4/vsync_o] [get_bd_pins paint_rectangle_5/vsync_i]
connect_bd_net [get_bd_pins paint_rectangle_5/hsync_o] [get_bd_pins paint_rectangle_6/hsync_i]
connect_bd_net [get_bd_pins paint_rectangle_5/pxl_value_o] [get_bd_pins paint_rectangle_6/pxl_value_i]
connect_bd_net [get_bd_pins paint_rectangle_5/pxl_x_o] [get_bd_pins paint_rectangle_6/pxl_x_i]
connect_bd_net [get_bd_pins paint_rectangle_5/pxl_y_o] [get_bd_pins paint_rectangle_6/pxl_y_i]
connect_bd_net [get_bd_pins paint_rectangle_5/video_enable_o] [get_bd_pins paint_rectangle_6/video_enable_i]
connect_bd_net [get_bd_pins paint_rectangle_5/vsync_o] [get_bd_pins paint_rectangle_6/vsync_i]
connect_bd_net [get_bd_pins paint_rectangle_6/hsync_o] [get_bd_pins hsync_o]
connect_bd_net [get_bd_pins paint_rectangle_6/pxl_value_o] [get_bd_pins pxl_value_o]
connect_bd_net [get_bd_pins paint_rectangle_6/pxl_x_o] [get_bd_pins pxl_x_o]
connect_bd_net [get_bd_pins paint_rectangle_6/pxl_y_o] [get_bd_pins pxl_y_o]
connect_bd_net [get_bd_pins paint_rectangle_6/video_enable_o] [get_bd_pins video_enable_o]
connect_bd_net [get_bd_pins paint_rectangle_6/vsync_o] [get_bd_pins vsync_o]
connect_bd_net -net pxl_value_i_0_1 [get_bd_pins pxl_value_i] [get_bd_pins paint_rectangle_0/pxl_value_i]
connect_bd_net -net pxl_x_i_0_1 [get_bd_pins pxl_x_i] [get_bd_pins paint_rectangle_0/pxl_x_i]
connect_bd_net -net pxl_y_i_0_1 [get_bd_pins pxl_y_i] [get_bd_pins paint_rectangle_0/pxl_y_i]
connect_bd_net -net reset_0_1 [get_bd_pins reset] [get_bd_pins seven_seg_display_co_0/reset]
connect_bd_net -net seg_pos_x_0_1 [get_bd_pins seg_pos_x] [get_bd_pins seven_seg_display_co_0/seg_pos_x]
connect_bd_net -net seg_pos_y_0_1 [get_bd_pins seg_pos_y] [get_bd_pins seven_seg_display_co_0/seg_pos_y]
connect_bd_net -net seg_size_x_0_1 [get_bd_pins seg_size_x] [get_bd_pins seven_seg_display_co_0/seg_size_x]
connect_bd_net -net seg_size_y_0_1 [get_bd_pins seg_size_y] [get_bd_pins seven_seg_display_co_0/seg_size_y]
connect_bd_net [get_bd_pins seven_seg_display_co_0/seg_a] [get_bd_pins paint_rectangle_0/enable]
connect_bd_net [get_bd_pins seven_seg_display_co_0/seg_a_pos_x] [get_bd_pins paint_rectangle_0/rect_pos_x]
connect_bd_net [get_bd_pins seven_seg_display_co_0/seg_a_pos_y] [get_bd_pins paint_rectangle_0/rect_pos_y]
connect_bd_net [get_bd_pins seven_seg_display_co_0/seg_b] [get_bd_pins paint_rectangle_1/enable]
connect_bd_net [get_bd_pins seven_seg_display_co_0/seg_b_pos_x] [get_bd_pins paint_rectangle_1/rect_pos_x]
connect_bd_net [get_bd_pins seven_seg_display_co_0/seg_b_pos_y] [get_bd_pins paint_rectangle_1/rect_pos_y]
connect_bd_net [get_bd_pins seven_seg_display_co_0/seg_c] [get_bd_pins paint_rectangle_2/enable]
connect_bd_net [get_bd_pins seven_seg_display_co_0/seg_c_pos_x] [get_bd_pins paint_rectangle_2/rect_pos_x]
connect_bd_net [get_bd_pins seven_seg_display_co_0/seg_c_pos_y] [get_bd_pins paint_rectangle_2/rect_pos_y]
connect_bd_net [get_bd_pins seven_seg_display_co_0/seg_d] [get_bd_pins paint_rectangle_3/enable]
connect_bd_net [get_bd_pins seven_seg_display_co_0/seg_d_pos_x] [get_bd_pins paint_rectangle_3/rect_pos_x]
connect_bd_net [get_bd_pins seven_seg_display_co_0/seg_d_pos_y] [get_bd_pins paint_rectangle_3/rect_pos_y]
connect_bd_net [get_bd_pins seven_seg_display_co_0/seg_e] [get_bd_pins paint_rectangle_4/enable]
connect_bd_net [get_bd_pins seven_seg_display_co_0/seg_e_pos_x] [get_bd_pins paint_rectangle_4/rect_pos_x]
connect_bd_net [get_bd_pins seven_seg_display_co_0/seg_e_pos_y] [get_bd_pins paint_rectangle_4/rect_pos_y]
connect_bd_net [get_bd_pins seven_seg_display_co_0/seg_f] [get_bd_pins paint_rectangle_5/enable]
connect_bd_net [get_bd_pins seven_seg_display_co_0/seg_f_pos_x] [get_bd_pins paint_rectangle_5/rect_pos_x]
connect_bd_net [get_bd_pins seven_seg_display_co_0/seg_f_pos_y] [get_bd_pins paint_rectangle_5/rect_pos_y]
connect_bd_net [get_bd_pins seven_seg_display_co_0/seg_g] [get_bd_pins paint_rectangle_6/enable]
connect_bd_net [get_bd_pins seven_seg_display_co_0/seg_g_pos_x] [get_bd_pins paint_rectangle_6/rect_pos_x]
connect_bd_net [get_bd_pins seven_seg_display_co_0/seg_g_pos_y] [get_bd_pins paint_rectangle_6/rect_pos_y]
connect_bd_net [get_bd_pins seven_seg_display_co_0/seg_hor_size_x] \
  [get_bd_pins paint_rectangle_0/rect_size_x] [get_bd_pins paint_rectangle_3/rect_size_x] \
  [get_bd_pins paint_rectangle_6/rect_size_x]
connect_bd_net [get_bd_pins seven_seg_display_co_0/seg_hor_size_y] \
  [get_bd_pins paint_rectangle_0/rect_size_y] [get_bd_pins paint_rectangle_3/rect_size_y] \
  [get_bd_pins paint_rectangle_6/rect_size_y]
connect_bd_net [get_bd_pins seven_seg_display_co_0/seg_ver_size_x] \
  [get_bd_pins paint_rectangle_1/rect_size_x] [get_bd_pins paint_rectangle_2/rect_size_x] \
  [get_bd_pins paint_rectangle_4/rect_size_x] [get_bd_pins paint_rectangle_5/rect_size_x]
connect_bd_net [get_bd_pins seven_seg_display_co_0/seg_ver_size_y] \
  [get_bd_pins paint_rectangle_1/rect_size_y] [get_bd_pins paint_rectangle_2/rect_size_y] \
  [get_bd_pins paint_rectangle_4/rect_size_y] [get_bd_pins paint_rectangle_5/rect_size_y]
connect_bd_net -net value_0_1 [get_bd_pins value] [get_bd_pins seven_seg_display_co_0/value]
connect_bd_net -net video_enable_i_0_1 [get_bd_pins video_enable_i] [get_bd_pins paint_rectangle_0/video_enable_i]
connect_bd_net -net vsync_i_0_1 [get_bd_pins vsync_i] [get_bd_pins paint_rectangle_0/vsync_i]

current_bd_instance /
connect_bd_net [get_bd_pins Constants/score_seg_size_x] [get_bd_pins paint_scoreboard/score_seg_size_x]
connect_bd_net [get_bd_pins Constants/scoreboard_center_offset] [get_bd_pins paint_scoreboard/scoreboard_center_offset]
connect_bd_net [get_bd_ports clk_100MHz] \
  [get_bd_pins controllers/clk] [get_bd_pins paint_scoreboard/clk] [get_bd_pins clk_divider_0/clk_i] \
  [get_bd_pins clk_wiz_0/clk_in1]
connect_bd_net [get_bd_ports reset] \
  [get_bd_pins controllers/reset] [get_bd_pins paint_scoreboard/reset] [get_bd_pins clk_divider_0/reset] \
  [get_bd_pins clk_wiz_0/reset] [get_bd_pins util_vector_logic_2/Op1] [get_bd_pins util_vector_logic_0/Op1]
connect_bd_net [get_bd_pins clk_divider_0/clk_o] [get_bd_pins position_ball_0/clk] [get_bd_pins score_counter_0/clk]
connect_bd_net [get_bd_pins Constants/screen_size_x] \
  [get_bd_pins paint_scoreboard/screen_size_x] [get_bd_pins collision_detection_0/screen_size_x] \
  [get_bd_pins paint_centerline_0/screen_size_x] [get_bd_pins position_ball_0/screen_size_x] \
  [get_bd_pins position_paddles_0/screen_size_x]
connect_bd_net [get_bd_pins Constants/screen_size_y] \
  [get_bd_pins collision_detection_0/screen_size_y] [get_bd_pins paint_centerline_0/screen_size_y] \
  [get_bd_pins position_ball_0/screen_size_y] [get_bd_pins position_paddles_0/screen_size_y]
connect_bd_net [get_bd_pins Constants/paddle_size_x] \
  [get_bd_pins collision_detection_0/paddle_size_x] [get_bd_pins paint_paddle_l/rect_size_x] \
  [get_bd_pins paint_paddle_r/rect_size_x] [get_bd_pins position_paddles_0/paddle_size_x]
connect_bd_net [get_bd_pins Constants/paddle_size_y] \
  [get_bd_pins collision_detection_0/paddle_size_y] [get_bd_pins paint_paddle_l/rect_size_y] \
  [get_bd_pins paint_paddle_r/rect_size_y] [get_bd_pins position_paddles_0/paddle_size_y]
connect_bd_net [get_bd_pins Constants/ball_size] \
  [get_bd_pins collision_detection_0/ball_size] [get_bd_pins paint_ball/rect_size_x] [get_bd_pins paint_ball/rect_size_y] \
  [get_bd_pins position_ball_0/ball_size]
connect_bd_net -net btn_down_0_1 [get_bd_ports btn_down_l] [get_bd_pins controllers/btn_down_0]
connect_bd_net -net btn_down_1_1 [get_bd_ports btn_down_r] [get_bd_pins controllers/btn_down_1]
connect_bd_net -net btn_up_0_1 [get_bd_ports btn_up_l] [get_bd_pins controllers/btn_up_0]
connect_bd_net -net btn_up_1_1 [get_bd_ports btn_up_r] [get_bd_pins controllers/btn_up_1]
connect_bd_net [get_bd_pins clk_wiz_0/clk_hdmi] \
  [get_bd_pins paint_scoreboard/pxlClk] [get_bd_pins paint_ball/clk] [get_bd_pins paint_centerline_0/clk] \
  [get_bd_pins paint_paddle_l/clk] [get_bd_pins paint_paddle_r/clk] [get_bd_pins rgb2dvi_0/PixelClk] [get_bd_pins v_tc_0/clk] \
  [get_bd_pins pixel_counter_0/pxCLK_i] [get_bd_pins video_buffer_0/pixel_clk]
connect_bd_net [get_bd_pins collision_detection_0/collision_ball_edge_l] [get_bd_pins score_counter_0/point_r] [get_bd_pins util_vector_logic_1/Op1]
connect_bd_net [get_bd_pins collision_detection_0/collision_ball_edge_r] [get_bd_pins score_counter_0/point_l] [get_bd_pins util_vector_logic_1/Op2]
connect_bd_net [get_bd_pins collision_detection_0/collision_ball_paddle] [get_bd_pins position_ball_0/collision_ball_paddle]
connect_bd_net [get_bd_pins collision_detection_0/collision_ball_topbottom] [get_bd_pins position_ball_0/collision_ball_topbottom]
connect_bd_net [get_bd_pins collision_detection_0/collision_paddle_index] [get_bd_pins position_ball_0/collision_ball_paddle_index]
connect_bd_net [get_bd_pins color_generator_0/data_o] [get_bd_pins video_buffer_0/Vdata_i]
connect_bd_net -net controller_interconn_0_value_l_o [get_bd_pins controllers/value_l_o] [get_bd_pins position_paddles_0/controller_value_l]
connect_bd_net -net controller_interconn_0_value_r_o [get_bd_pins controllers/value_r_o] [get_bd_pins position_paddles_0/controller_value_r]
connect_bd_net -net controller_ultrasonic_0_trigger [get_bd_pins controllers/trigger_0] [get_bd_ports trigger_l]
connect_bd_net -net controller_ultrasonic_1_trigger [get_bd_pins controllers/trigger_1] [get_bd_ports trigger_r]
connect_bd_net -net enable_0_1 [get_bd_ports enable] \
  [get_bd_pins paint_ball/enable] [get_bd_pins paint_paddle_l/enable] [get_bd_pins paint_paddle_r/enable] \
  [get_bd_pins position_ball_0/enable]
connect_bd_net [get_bd_ports game_reset] [get_bd_pins util_vector_logic_0/Op2]
connect_bd_net [get_bd_pins one/dout] [get_bd_ports hdmi_out_hpd]
connect_bd_net [get_bd_pins paint_ball/video_enable_o] [get_bd_pins paint_paddle_l/video_enable_i]
connect_bd_net [get_bd_pins paint_centerline_0/hsync_o] [get_bd_pins paint_scoreboard/hsync_i]
connect_bd_net [get_bd_pins paint_centerline_0/pxl_value_o] [get_bd_pins paint_scoreboard/pxl_value_i]
connect_bd_net [get_bd_pins paint_centerline_0/pxl_x_o] [get_bd_pins paint_scoreboard/pxl_x_i]
connect_bd_net [get_bd_pins paint_paddle_l/video_enable_o] [get_bd_pins paint_paddle_r/video_enable_i]
connect_bd_net [get_bd_pins paint_paddle_r/video_enable_o] [get_bd_pins paint_centerline_0/video_enable_i]
connect_bd_net -net paint_rectangle_0_hsync_o [get_bd_pins paint_ball/hsync_o] [get_bd_pins paint_paddle_l/hsync_i]
connect_bd_net -net paint_rectangle_0_pxl_value_o [get_bd_pins paint_ball/pxl_value_o] [get_bd_pins paint_paddle_l/pxl_value_i]
connect_bd_net -net paint_rectangle_0_pxl_x_o [get_bd_pins paint_ball/pxl_x_o] [get_bd_pins paint_paddle_l/pxl_x_i]
connect_bd_net -net paint_rectangle_0_pxl_y_o [get_bd_pins paint_ball/pxl_y_o] [get_bd_pins paint_paddle_l/pxl_y_i]
connect_bd_net -net paint_rectangle_0_vsync_o [get_bd_pins paint_ball/vsync_o] [get_bd_pins paint_paddle_l/vsync_i]
connect_bd_net -net paint_rectangle_1_hsync_o [get_bd_pins paint_paddle_l/hsync_o] [get_bd_pins paint_paddle_r/hsync_i]
connect_bd_net -net paint_rectangle_1_pxl_value_o [get_bd_pins paint_paddle_l/pxl_value_o] [get_bd_pins paint_paddle_r/pxl_value_i]
connect_bd_net -net paint_rectangle_1_pxl_x_o [get_bd_pins paint_paddle_l/pxl_x_o] [get_bd_pins paint_paddle_r/pxl_x_i]
connect_bd_net -net paint_rectangle_1_pxl_y_o [get_bd_pins paint_paddle_l/pxl_y_o] [get_bd_pins paint_paddle_r/pxl_y_i]
connect_bd_net -net paint_rectangle_1_vsync_o [get_bd_pins paint_paddle_l/vsync_o] [get_bd_pins paint_paddle_r/vsync_i]
connect_bd_net -net paint_rectangle_2_hsync_o [get_bd_pins paint_paddle_r/hsync_o] [get_bd_pins paint_centerline_0/hsync_i]
connect_bd_net -net paint_rectangle_2_pxl_value_o [get_bd_pins paint_paddle_r/pxl_value_o] [get_bd_pins paint_centerline_0/pxl_value_i]
connect_bd_net -net paint_rectangle_2_pxl_x_o [get_bd_pins paint_paddle_r/pxl_x_o] [get_bd_pins paint_centerline_0/pxl_x_i]
connect_bd_net -net paint_rectangle_2_pxl_y_o [get_bd_pins paint_paddle_r/pxl_y_o] [get_bd_pins paint_centerline_0/pxl_y_i]
connect_bd_net -net paint_rectangle_2_vsync_o [get_bd_pins paint_paddle_r/vsync_o] [get_bd_pins paint_centerline_0/vsync_i]
connect_bd_net [get_bd_pins paint_scoreboard/hsync_o] [get_bd_pins video_buffer_0/HSync_i]
connect_bd_net [get_bd_pins paint_scoreboard/pxl_value_o] [get_bd_pins color_generator_0/enable_i]
connect_bd_net [get_bd_pins paint_scoreboard/video_enable_o] [get_bd_pins video_buffer_0/Vdata_enable_i]
connect_bd_net [get_bd_pins paint_scoreboard/vsync_o] [get_bd_pins video_buffer_0/VSync_i]
connect_bd_net [get_bd_pins pixel_counter_0/hpx_o] [get_bd_pins paint_ball/pxl_x_i]
connect_bd_net [get_bd_pins pixel_counter_0/hsync_o] [get_bd_pins paint_ball/hsync_i]
connect_bd_net [get_bd_pins pixel_counter_0/video_enable_o] [get_bd_pins paint_ball/video_enable_i]
connect_bd_net [get_bd_pins pixel_counter_0/vpx_o] [get_bd_pins paint_ball/pxl_y_i]
connect_bd_net [get_bd_pins pixel_counter_0/vsync_o] [get_bd_pins paint_ball/vsync_i]
connect_bd_net [get_bd_pins position_ball_0/ball_pos_x] [get_bd_pins collision_detection_0/ball_pos_x] [get_bd_pins paint_ball/rect_pos_x]
connect_bd_net [get_bd_pins position_ball_0/ball_pox_y] [get_bd_pins collision_detection_0/ball_pos_y] [get_bd_pins paint_ball/rect_pos_y]
connect_bd_net [get_bd_pins position_paddles_0/paddle_l_pos_x] \
  [get_bd_pins collision_detection_0/paddle_l_pos_x] [get_bd_pins paint_paddle_l/rect_pos_x]
connect_bd_net [get_bd_pins position_paddles_0/paddle_l_pos_y] \
  [get_bd_pins collision_detection_0/paddle_l_pos_y] [get_bd_pins paint_paddle_l/rect_pos_y]
connect_bd_net [get_bd_pins position_paddles_0/paddle_r_pos_x] \
  [get_bd_pins collision_detection_0/paddle_r_pos_x] [get_bd_pins paint_paddle_r/rect_pos_x]
connect_bd_net [get_bd_pins position_paddles_0/paddle_r_pos_y] \
  [get_bd_pins collision_detection_0/paddle_r_pos_y] [get_bd_pins paint_paddle_r/rect_pos_y]
connect_bd_net -net pxl_y_i_1 [get_bd_pins paint_centerline_0/pxl_y_o] [get_bd_pins paint_scoreboard/pxl_y_i]
connect_bd_net [get_bd_pins rgb2dvi_0/TMDS_Clk_n] [get_bd_ports hdmi_out_clk_n]
connect_bd_net [get_bd_pins rgb2dvi_0/TMDS_Clk_p] [get_bd_ports hdmi_out_clk_p]
connect_bd_net [get_bd_pins rgb2dvi_0/TMDS_Data_n] [get_bd_ports hdmi_out_data_n]
connect_bd_net [get_bd_pins rgb2dvi_0/TMDS_Data_p] [get_bd_ports hdmi_out_data_p]
connect_bd_net [get_bd_pins score_counter_0/game_reset] [get_bd_pins util_vector_logic_2/Op2]
connect_bd_net [get_bd_pins score_counter_0/score_right] [get_bd_pins paint_scoreboard/score_r]
connect_bd_net -net score_l_1 [get_bd_pins score_counter_0/score_left] [get_bd_pins paint_scoreboard/score_l]
connect_bd_net -net score_seg_size_y_1 [get_bd_pins Constants/score_seg_size_y] [get_bd_pins paint_scoreboard/score_seg_size_y]
connect_bd_net -net scoreboard_top_offset_1 [get_bd_pins Constants/scoreboard_top_offset] [get_bd_pins paint_scoreboard/scoreboard_top_offset]
connect_bd_net -net sensor_0_1 [get_bd_ports sensor_l] [get_bd_pins controllers/sensor_0]
connect_bd_net -net sensor_1_1 [get_bd_ports sensor_r] [get_bd_pins controllers/sensor_1]
connect_bd_net -net switch_0_1 [get_bd_ports controller_switch] [get_bd_pins controllers/switch_0]
connect_bd_net [get_bd_pins util_vector_logic_0/Res] [get_bd_pins score_counter_0/reset]
connect_bd_net [get_bd_pins util_vector_logic_1/Res] [get_bd_pins position_ball_0/collision_ball_edge]
connect_bd_net [get_bd_pins util_vector_logic_2/Res] [get_bd_pins position_ball_0/reset]
connect_bd_net [get_bd_pins v_tc_0/active_video_out] [get_bd_pins pixel_counter_0/video_enable_i]
connect_bd_net [get_bd_pins v_tc_0/hblank_out] [get_bd_pins pixel_counter_0/hblank_i]
connect_bd_net [get_bd_pins v_tc_0/hsync_out] [get_bd_pins pixel_counter_0/hsync_i]
connect_bd_net [get_bd_pins v_tc_0/vblank_out] [get_bd_pins pixel_counter_0/vblank_i]
connect_bd_net [get_bd_pins v_tc_0/vsync_out] [get_bd_pins pixel_counter_0/vsync_i]
connect_bd_net [get_bd_pins video_buffer_0/HSync_o] [get_bd_pins rgb2dvi_0/vid_pHSync]
connect_bd_net [get_bd_pins video_buffer_0/VSync_o] [get_bd_pins rgb2dvi_0/vid_pVSync]
connect_bd_net [get_bd_pins video_buffer_0/Vdata_enable_o] [get_bd_pins rgb2dvi_0/vid_pVDE]
connect_bd_net [get_bd_pins video_buffer_0/Vdata_o] [get_bd_pins rgb2dvi_0/vid_pData]
connect_bd_net -net video_enable_i_1 [get_bd_pins paint_centerline_0/video_enable_o] [get_bd_pins paint_scoreboard/video_enable_i]
connect_bd_net -net vsync_i_1 [get_bd_pins paint_centerline_0/vsync_o] [get_bd_pins paint_scoreboard/vsync_i]
connect_bd_net -net xlconstant_5_dout [get_bd_pins Constants/paddle_offset_x] [get_bd_pins position_paddles_0/paddle_offset_x]
connect_bd_net -net xlconstant_6_dout [get_bd_pins Constants/max_score] [get_bd_pins score_counter_0/max_score]
connect_bd_net [get_bd_pins zero/dout] [get_bd_pins paint_ball/pxl_value_i]

validate_bd_design
save_bd_design
